# Altium project Pmod_DA4.PrjPcb
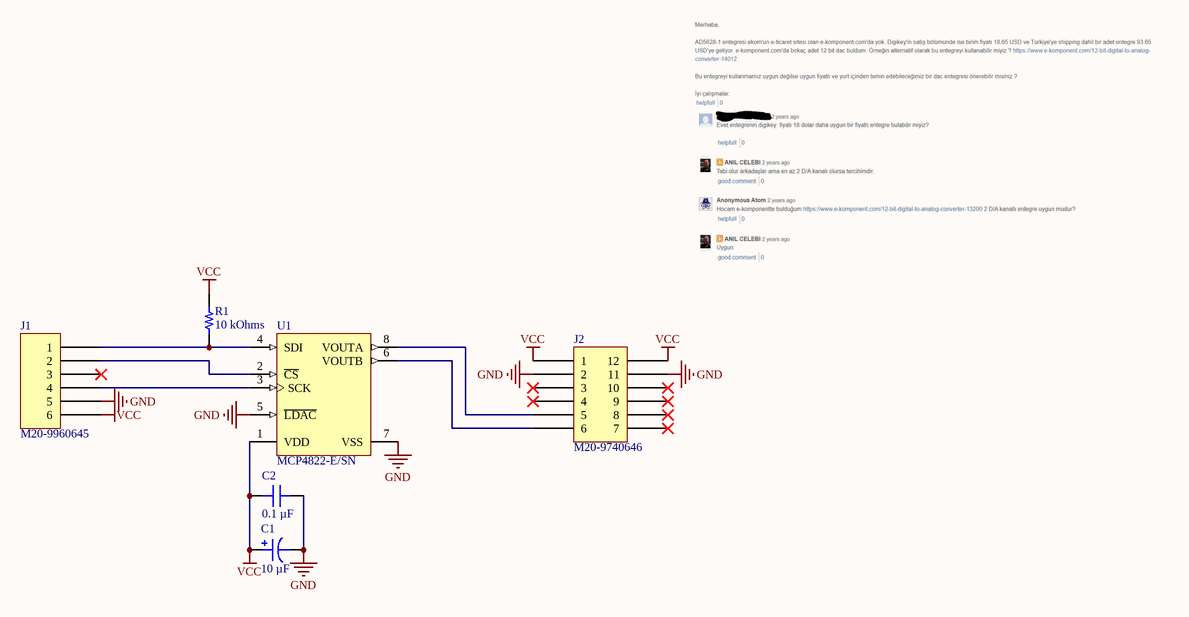
[diagram p0: Pmod_DA4.SchDoc]
1 sheet, 6 parts. Net scope: global (net labels, ports and power ports of the same name join across sheets).
Board file: Pmod_DA4.PcbDoc

## Sheet Pmod_DA4.SchDoc
size A4; SheetNumber: 1; SheetTotal: 1

### Parts
C1  10 µF  [CAP POL 2917_7343]
C2  0.1 µF  [CAP 0805_2012]
J1  M20-9960645  [HARWIN M20-9960645]
J2  M20-9740646  [HARWIN M20-9740645]
R1  10 kOhms  [RES 0805_2012]
U1  MCP4822-E/SN  [SOIC-SN8_M]

### Nets
GND: C1.2 C2.1 J1.5 J2.2 J2.11 U1.5(~{LDAC}) U1.7(VSS)
VCC: C1.1 C2.2 J1.6 J2.1 J2.12 R1.2 U1.1(VDD)
NetJ1_1: J1.1 R1.1 U1.4(SDI)
NetJ1_2: J1.2 U1.2(~{CS})
NetJ1_4: J1.4 U1.3(SCK)
NetJ2_5: J2.5 U1.8(VOUTA)
NetJ2_6: J2.6 U1.6(VOUTB)

Not connected (* = marked no-connect by the designer): J1 3*; J2 3* 4* 7* 8* 9* 10*

### Library data of the parts
C1 = 293D106X0050E2TE3: CAP TANT 10UF 20% 50V 2917; manufacturer: Vishay Sprague; Manufacturer Size Code: E; ESR (Equivalent Series Resistance): 800mOhm; Type: Molded; Part Number: 293D106X0050E2TE3; Value: 10 µF; Capacitance: 10 µF; componentlink1description: Datasheet; componentlink1url: http://www.vishay.com/docs/40002/293d.pdf; componentlink2description: DigiKey Link; componentlink2url: https://www.digikey.com/en/products/detail/vishay-sprague/293D106X0050E2TE3/1578612; Device Package: 2917 (7343 Metric); Features: General Purpose; Height - Seated (Max): 0.170" (4.32mm); lastupdated: 13.07.2023 19:40:38; Lifecycle Status: Active; Minimum Order: 1; Mounting Type: Surface Mount; Operating Temperature: -55°C ~ 125°C; Package / Case: 2917 (7343 Metric); packaging: TapeAndReel; partid: 653; Part Status: Active; price: 0.65; series: TANTAMOUNT®, 293D; Size / Dimension: 0.287" L x 0.169" W (7.30mm x 4.30mm); Supplier 1: DigiKey; Supplier Part Number 1: 718-1957-1-ND; Tolerance: ±20%; Voltage - Rated: 50 V
C2 = CC0805MRX7R9BB104: CAP CER 0.1UF 50V X7R 0805; manufacturer: Yageo; Tolerance: ±20%; Part Number: CC0805MRX7R9BB104; Value: 0.1 µF; Applications: General Purpose; Capacitance: 0.1 µF; componentlink1description: Datasheet; componentlink1url: https://www.yageo.com/upload/media/product/productsearch/datasheet/mlcc/UPY-GPHC_X7R_6.3V-to-50V_18.pdf; componentlink2description: DigiKey Link; componentlink2url: https://www.digikey.com/en/products/detail/yageo/CC0805MRX7R9BB104/5884281; Device Package: 0805 (2012 Metric); lastupdated: 15.07.2023 19:12:08; Lifecycle Status: Active; Minimum Order: 1; Mounting Type: Surface Mount, MLCC; Operating Temperature: -55°C ~ 125°C; Package / Case: 0805 (2012 Metric); packaging: TapeAndReel; partid: 2475; Part Status: Active; price: 0.01; series: CC; Size / Dimension: 0.079" L x 0.049" W (2.00mm x 1.25mm); Supplier 1: DigiKey; Supplier Part Number 1: 311-4351-1-ND; Temperature Coefficient: X7R; Thickness (Max): 0.037" (0.95mm); Voltage - Rated: 50V
J1 = M20-9960645: CONN HEADER R/A 6POS 2.54MM; Manufacturer: Harwin Inc.; Connector Type: Header, Cuttable; Contact Length - Mating: 0.240" (6.10mm); Contact Length - Post: 0.118" (3.00mm); Current Rating (Amps): 3A per Contact; Material Flammability Rating: UL94 V-0; Number of Positions: 6; Number of Positions Loaded: All; Pitch - Mating: 0.100" (2.54mm); Row Spacing - Mating: -40°C ~ 105°C; Shrouding: Unshrouded; Style: Board to Board or Cable; Part Number: M20-9960645; ComponentLink1Description: Datasheet; ComponentLink1URL: https://cdn.harwin.com/pdfs/Harwin_PC_Connectors_M20.pdf; ComponentLink2Description: DigiKey Link; ComponentLink2URL: https://www.digikey.com/en/products/detail/harwin-inc/M20-9960645/3728211; Contact Finish - Mating: Gold; Contact Material: Brass; Contact Shape: Square; Contact Type: Male Pin; Fastening Type: Push-Pull; Insulation Color: Black; Insulation Height: 0.100" (2.54mm); Insulation Material: Polyamide (PA6T), Nylon 6T; LastUpdated: 21.09.2022 19:23:50; Lifecycle Status: Active; Minimum Order: 1; Mounting Type: Through Hole, Right Angle; Number of Rows: 1; Operating Temperature: -40°C ~ 105°C; Packaging: Bulk; PartId: 169; Part Status: Active; Price: 0.16; Series: M20; Supplier 1: DigiKey; Supplier Part Number 1: 952-2247-ND; Termination: Solder
J2 = M20-9740646: CONN HEADER R/A 12POS 2.54MM; Manufacturer: Harwin Inc.; Connector Type: Header, Cuttable; Current Rating (Amps): 3A per Contact; Material Flammability Rating: UL94 V-0; Number of Positions: 12; Number of Positions Loaded: All; Shrouding: Unshrouded; Style: Board to Board or Cable; Part Number: M20-9740646; ComponentLink1Description: Datasheet; ComponentLink1URL: https://cdn.harwin.com/pdfs/M20-974.pdf; ComponentLink2Description: DigiKey Link; ComponentLink2URL: http://digikey.com/product-detail/en/harwin-inc/M20-9740646/M20-9740646-ND/3920719; Contact Finish - Mating: Tin; Contact Finish - Post: Tin; Contact Material: Brass; Contact Shape: Square; Contact Type: Male Pin; Fastening Type: Push-Pull; Insulation Color: Black; Insulation Material: Polyamide (PA6T), Nylon 6T; LastUpdated: 21.09.2022 19:18:29; Lifecycle Status: Active; Minimum Order: 1500; Mounting Type: Through Hole, Right Angle; Number of Rows: 2; Operating Temperature: -40°C ~ 105°C; Packaging: Bulk; PartId: 159; Part Status: Active; Price: 0.27; Series: M20; Supplier 1: DigiKey; Supplier Part Number 1: M20-9740646-ND; Termination: Solder
R1 = TNPU080510K0AWEN00: TNPU0805 10K 0.05% 2PPM E52 E3; Manufacturer: Vishay Dale; Power (Watts): 0.125W, 1/8W; Temperature Coefficient: ±2ppm/°C; Part Number: TNPU080510K0AWEN00; Value: 10 kOhms; ComponentLink2Description: DigiKey Link; ComponentLink2URL: https://www.digikey.com/en/products/detail/vishay-dale/TNPU080510K0AWEN00/11618047; Composition: Thin Film; Device Package: 0805 (2012 Metric); Features: Anti-Sulfur, Automotive AEC-Q200, Moisture Resistant; Height - Seated (Max): 0.022" (0.55mm); LastUpdated: 19.07.2023 19:10:50; Lifecycle Status: Active; Minimum Order: 1; Number of Terminations: 2; Operating Temperature: -55°C ~ 125°C; Package / Case: 0805 (2012 Metric); Packaging: TapeAndReel; PartId: 61852; Part Status: Active; Price: 2.39; Ratings: AEC-Q200; Resistance: 10 kOhms; Series: TNPU e3; Size / Dimension: 0.079" L x 0.049" W (2.00mm x 1.25mm); Supplier 1: DigiKey; Supplier Part Number 1: 541-TNPU080510K0AWEN00CT-ND; Supplier Device Package: 0805; Tolerance: ±0.05%
U1 = CMP-0188-00505-2: 12-Bit DACs with Internal VREF and SPI Interface, 8-Pin SOIC 150mil, Extended Temperature; DatasheetVersion: revA, Apr-2010; ComponentLink3Description: Package Specification; Code_IPC: SOIC127P600-8; ComponentLink2URL: http://ww1.microchip.com/downloads/en/DeviceDoc/22249A.pdf; PackageVersion: revBB, Aug-2009; ComponentLink1Description: Manufacturer URL; PackageDescription: 8-Lead Plastic Small Outline (SN) - Narrow, 3.90mm Body [SOIC]; ComponentLink1URL: http://www.microchip.com/; PackageReference: SOIC-SN8; Code_JEDEC: MS-012; ComponentLink2Description: Datasheet; RevisionNote: URLs added. DatasheetVersion updated. Sch updated.; ComponentLink3URL: http://www.microchip.com/stellent/groups/techpub_sg/documents/packagingspec/en012702.pdf